# Altium schematic sheet LCD.SchDoc
size A4; Organization: Altium Limited; Address1: L3, 12a Rodborough Rd; Address2: Frenchs Forest; Address3: NSW; Address4: Australia 2086; SheetNumber: 2; SheetTotal: 5
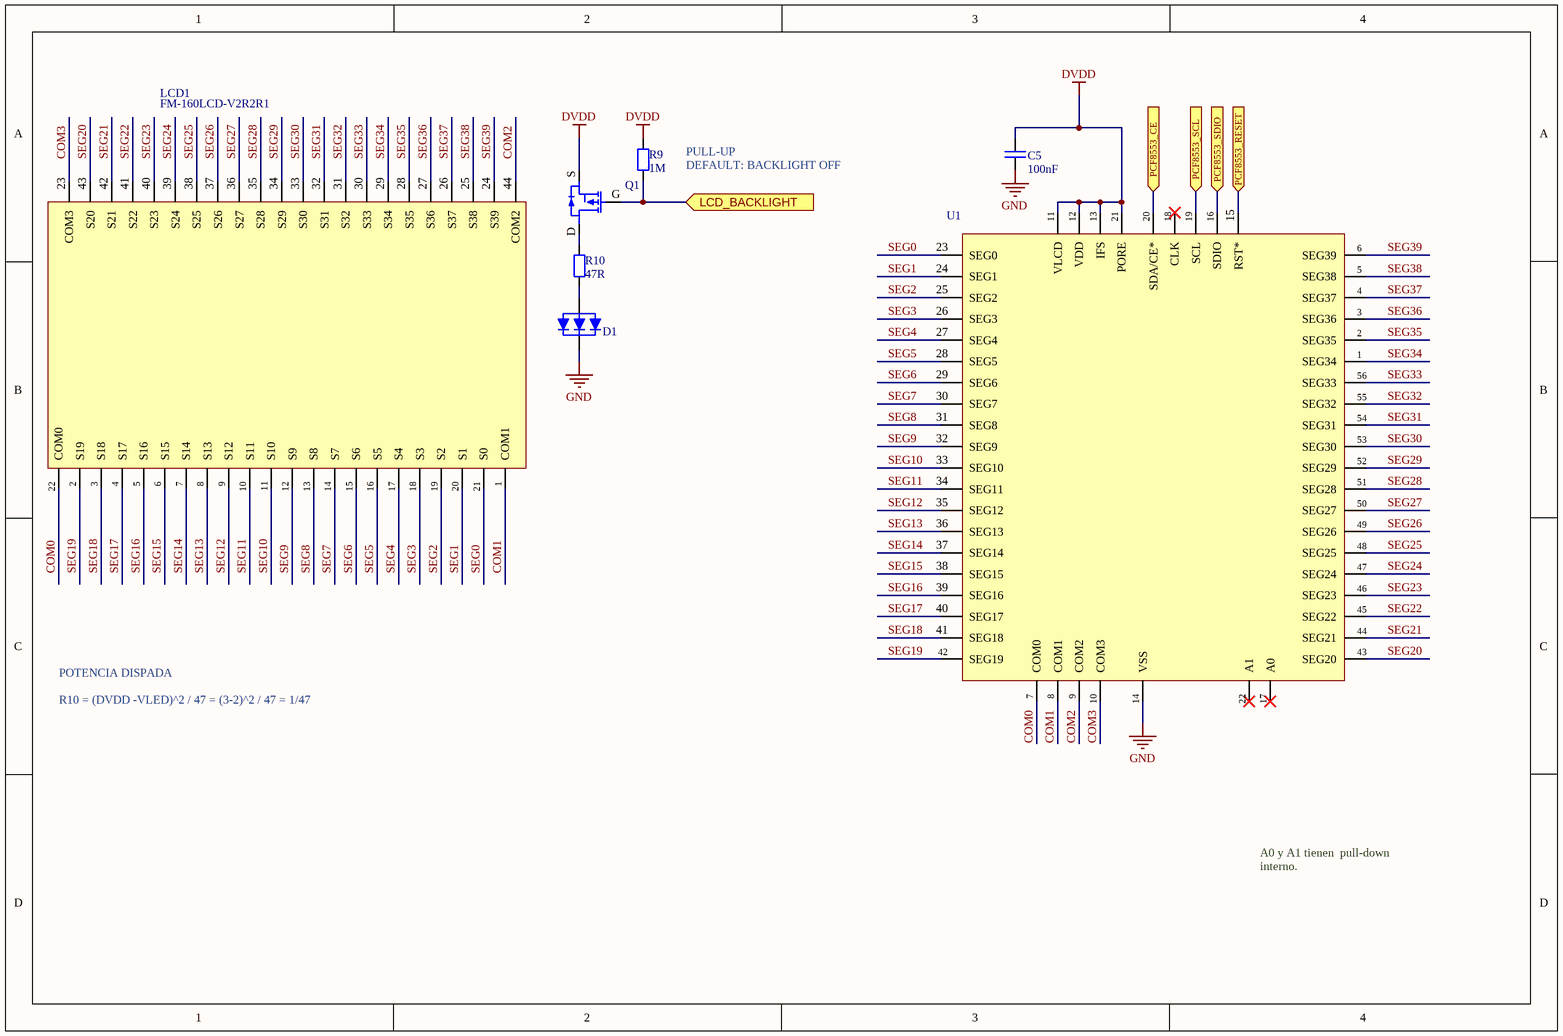
[diagram p0: LCD.SchDoc]

## Parts
C5  100nF  [CAP_SM0805_YAGEOCC2_N]
D1  BACKLIGHT  [BACKLIGHT]  (value not drawn)  (no BOM)
LCD1  FM-160LCD-V2R2R1  [FMC-160LCD V2]
Q1  DMG3401LSN-7  [DMG3401LSN-7]  (value not drawn)
R9  1M  [RES_SM0805_YAGEORC_N]
R10  47R  [RES_SM0805_YAGEORC_N]
U1  PCF8553DTT/AY  [LCD DRIVER - TSSOP56]  (value not drawn)

## Ports
LCD_BACKLIGHT (in), PCF8553_CE (in), PCF8553_RESET (in), PCF8553_SCL (in), PCF8553_SDIO (in)

## Nets
DVDD: C5.1 Q1.S R9.2 U1.11(VLCD) U1.12(VDD) U1.13(IFS) U1.21(PORE)
GND: C5.2 D1.2 U1.14(VSS)
COM0: LCD1.22(COM0) U1.7(COM0)
COM1: LCD1.1(COM1) U1.8(COM1)
COM2: LCD1.44(COM2) U1.9(COM2)
COM3: LCD1.23(COM3) U1.10(COM3)
LCD_BACKLIGHT: Q1.G R9.1 ; port LCD_BACKLIGHT
PCF8553_CE: U1.20(SDA/CE*) ; port PCF8553_CE
PCF8553_RESET: U1.15(RST*) ; port PCF8553_RESET
PCF8553_SCL: U1.19(SCL) ; port PCF8553_SCL
PCF8553_SDIO: U1.16(SDIO) ; port PCF8553_SDIO
SEG0: LCD1.21(S0) U1.23(SEG0)
SEG1: LCD1.20(S1) U1.24(SEG1)
SEG2: LCD1.19(S2) U1.25(SEG2)
SEG3: LCD1.18(S3) U1.26(SEG3)
SEG4: LCD1.17(S4) U1.27(SEG4)
SEG5: LCD1.16(S5) U1.28(SEG5)
SEG6: LCD1.15(S6) U1.29(SEG6)
SEG7: LCD1.14(S7) U1.30(SEG7)
SEG8: LCD1.13(S8) U1.31(SEG8)
SEG9: LCD1.12(S9) U1.32(SEG9)
SEG10: LCD1.11(S10) U1.33(SEG10)
SEG11: LCD1.10(S11) U1.34(SEG11)
SEG12: LCD1.9(S12) U1.35(SEG12)
SEG13: LCD1.8(S13) U1.36(SEG13)
SEG14: LCD1.7(S14) U1.37(SEG14)
SEG15: LCD1.6(S15) U1.38(SEG15)
SEG16: LCD1.5(S16) U1.39(SEG16)
SEG17: LCD1.4(S17) U1.40(SEG17)
SEG18: LCD1.3(S18) U1.41(SEG18)
SEG19: LCD1.2(S19) U1.42(SEG19)
SEG20: LCD1.43(S20) U1.43(SEG20)
SEG21: LCD1.42(S21) U1.44(SEG21)
SEG22: LCD1.41(S22) U1.45(SEG22)
SEG23: LCD1.40(S23) U1.46(SEG23)
SEG24: LCD1.39(S24) U1.47(SEG24)
SEG25: LCD1.38(S25) U1.48(SEG25)
SEG26: LCD1.37(S26) U1.49(SEG26)
SEG27: LCD1.36(S27) U1.50(SEG27)
SEG28: LCD1.35(S28) U1.51(SEG28)
SEG29: LCD1.34(S29) U1.52(SEG29)
SEG30: LCD1.33(S30) U1.53(SEG30)
SEG31: LCD1.32(S31) U1.54(SEG31)
SEG32: LCD1.31(S32) U1.55(SEG32)
SEG33: LCD1.30(S33) U1.56(SEG33)
SEG34: LCD1.29(S34) U1.1(SEG34)
SEG35: LCD1.28(S35) U1.2(SEG35)
SEG36: LCD1.27(S36) U1.3(SEG36)
SEG37: LCD1.26(S37) U1.4(SEG37)
SEG38: LCD1.25(S38) U1.5(SEG38)
SEG39: LCD1.24(S39) U1.6(SEG39)
NetD1_1: D1.1 R10.1
NetQ1_D: Q1.D R10.2

Not connected (* = marked no-connect by the designer): U1 17(A0)* 18(CLK)* 22(A1)*

## Notes on the sheet
- (near R9) PULL-UP
  DEFAULT: BACKLIGHT OFF
- POTENCIA DISPADA
  R10 = (DVDD -VLED)^2 / 47 = (3-2)^2 / 47 = 1/47
- A0 y A1 tienen  pull-down interno.
- Title:
- Size: A4
- Date:
- FMC-320U MODEL A
- Sheet:
- Time:
- Of:
- Version:
- Revision:
- Release:
- 1
- 0
- FLOWMEET SRL
- File

## Library data of the parts
C5 = CC0805KRX7R8BB104: CAP 100nF SM0805 X7R 25V YAGEO CC2; Tolerance (%): 10; Voltage Rating (Volts): 25; Category: Capacitor; Manufacturer: Yageo; Manufacturer Part Number: CC0805KRX7R8BB104; Package: 0805; Value: 100nF; Supplier Part Number 1: 644249; Supplier 1: Farnell; ComponentLink1URL: http://www.yageo.com; ComponentLink1Description: Manufacturer Website; Supplier 2: Digi-Key; Supplier Part Number 2: 311-1141-1-ND; Datasheet: https://datasheet.lcsc.com/lcsc/2006111832_YAGEO-CC0805KRX7R8BB104_C519981.pdf
D1 = FM-160-BACKLIGHT: IF=45mA;VF=3V; Manufacturer: FLOWMEET; Manufacturer Part Number: FM-160-BACKLIGHT; Category: Backlight; Datasheet: -; Temperature Max: -; Temperature Min: -
LCD1 = FM-160LCD-V2R2R1: Manufacturer: FLOWMEET; Manufacturer Part Number: FM-160LCD-V2R2R1; Category: LCD; Datasheet: -; Temperature Max: 70; Temperature Min: -20
Q1 = DMG3401LSN-7: P-CHANNEL ENHANCEMENT MODE MOSFET / RDS(ON) = 85mΩ @ VGS = -2.5V -> ID -2.7A / V(BR)DDS 30V; Manufacturer: Diodes Incorporated; Category: Transistor mosfet; Manufacturer Part Number: DMG3401LSN-7; Datasheet: https://www.diodes.com/assets/Datasheets/DMG3401LSN.pdf; Temperature Max: 150; Temperature Min: -55
R9 = RC0805FR-071ML: RES 1M SM0805 YAGEO RC_L; Power (Watts): 0.125; Resistance (Ohms): 1000000; Tolerance (%): 1; Category: Resistor; Manufacturer: Yageo; Manufacturer Part Number: RC0805FR-071ML; Package: 0805; Value: 1M; Supplier Part Number 1: 9237992; Supplier 1: Farnell; ComponentLink1URL: http://www.yageo.com; ComponentLink1Description: Manufacturer Website; Supplier 2: Digi-Key; Supplier Part Number 2: 311-1.00MCRCT-ND; Datasheet: https://www.yageo.com/upload/media/product/productsearch/datasheet/rchip/PYu-RC_Group_51_RoHS_L_12.pdf
R10 = RC0805FR-0747RL: RES 47R SM0805 YAGEO RC_L; Power (Watts): 0.125; Resistance (Ohms): 47; Tolerance (%): 1; Category: Resistor; Manufacturer: Yageo; Manufacturer Part Number: RC0805FR-0747RL; Package: 0805; Value: 47R; Supplier Part Number 1: 9237321; Supplier 1: Farnell; ComponentLink1Description: Manufacturer Website; ComponentLink1URL: http://www.yageo.com; Supplier 2: Digi-Key; Supplier Part Number 2: 311-47.0CRCT-ND; Datasheet: https://www.yageo.com/upload/media/product/app/datasheet/rchip/pyu-rc_group_51_rohs_l.pdf
U1 = PCF8553DTT/AY: 40 × 4 LCD SEGMENT DRIVER; Manufacturer: NXP; Manufacturer Part Number: PCF8553DTT/AY; Category: Driver; Datasheet: https://datasheet.lcsc.com/lcsc/2107141507_NXP-Semicon-PCF8553DTT-AJ_C2653705.pdf; Temperature Max: 85; Temperature Min: -40